# EAGLE design VCNL4040_IR_Finger_Sensor (EAGLE 7.7.0)
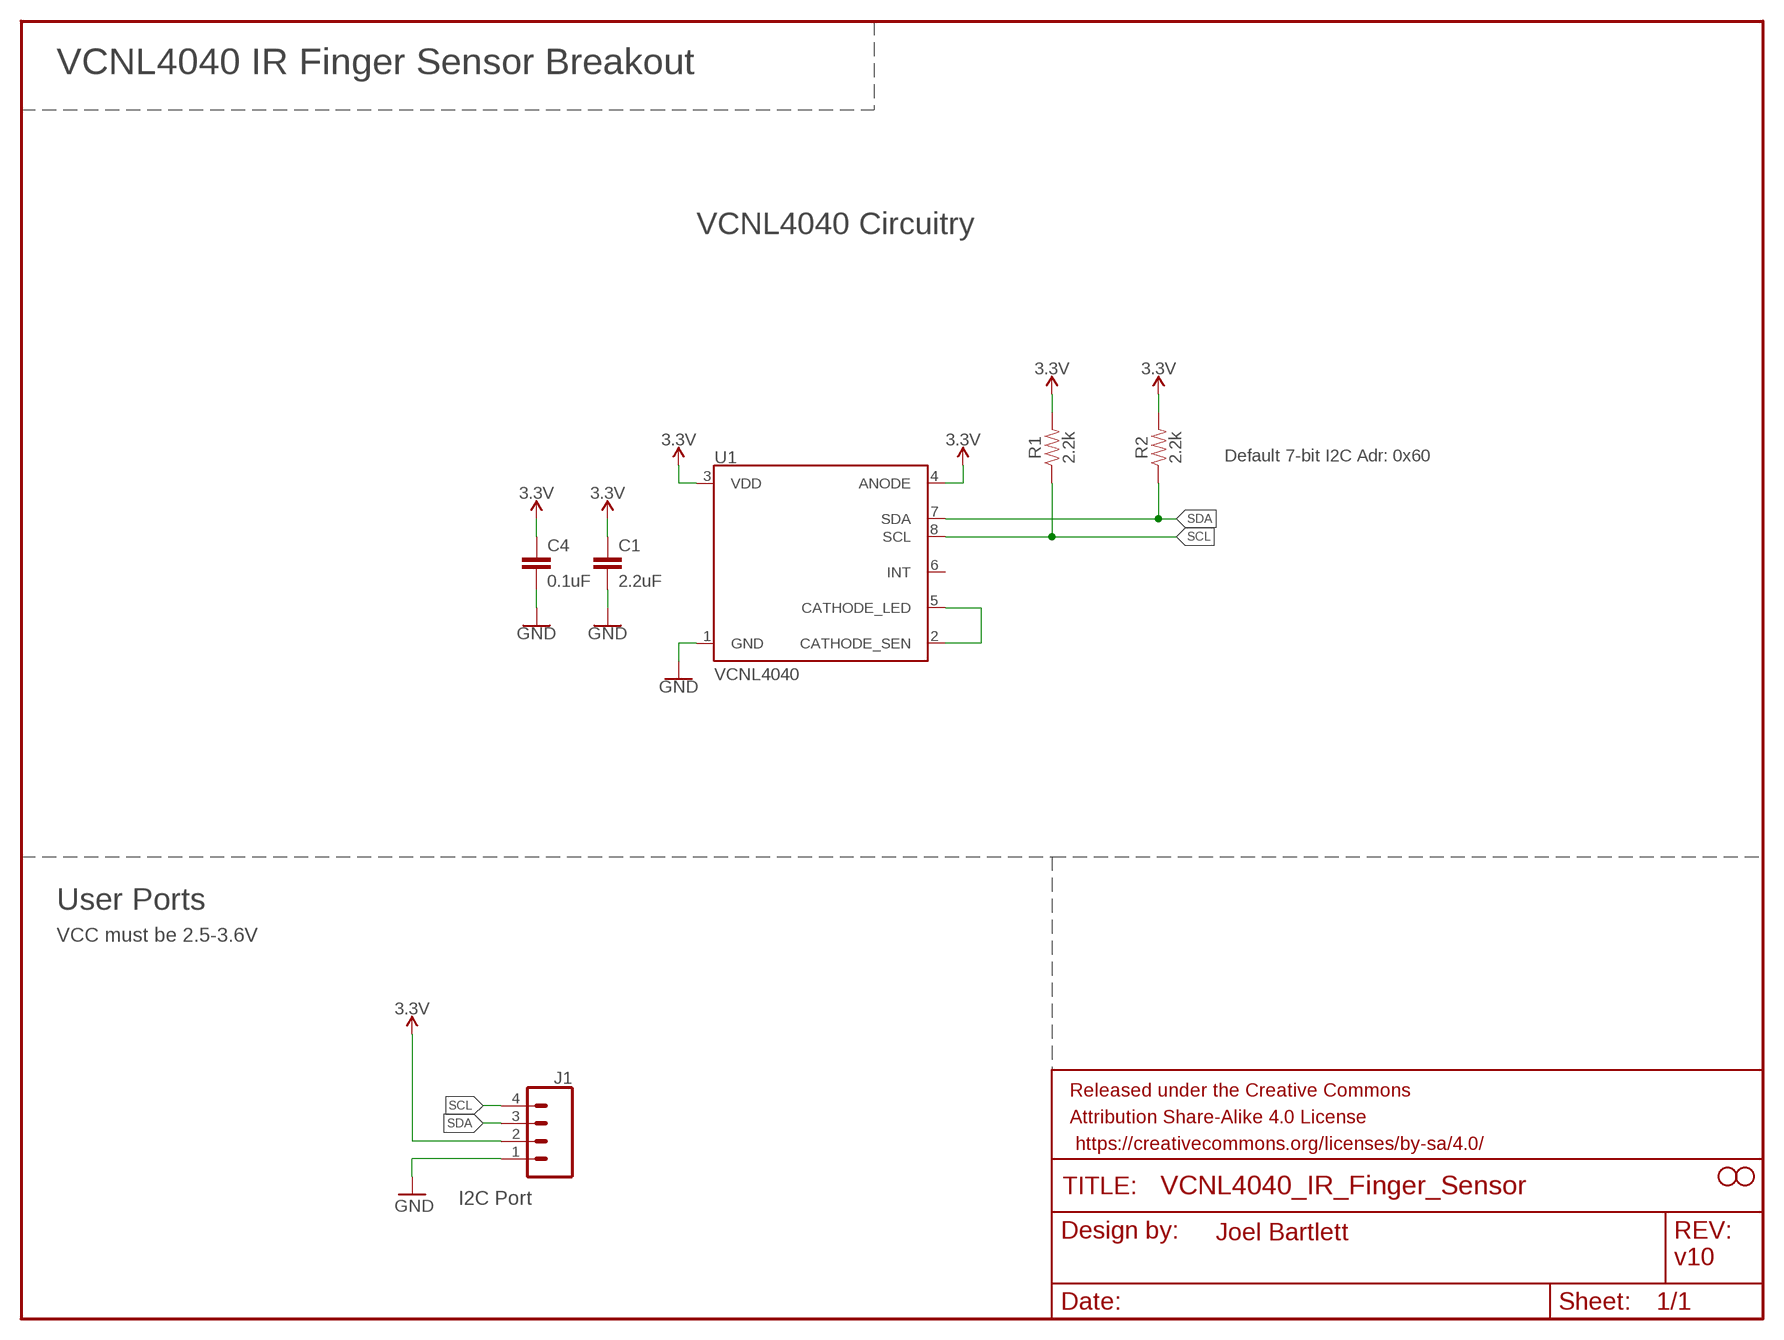
[diagram p0: schematic, sheet 1]

## Parts
C1  2.2uF  2.2UF-0603-10V-20%  [0603]
C4  0.1uF  0.1UF-0603-25V-(+80/-20%)  [0603]
FRAME2  FRAME-LETTER  [CREATIVE_COMMONS]
J1  CONN_04SMD2  [1X04_1MM_RA]
R1  2.2k  2.2KOHM-0603-1/10W-1%  [0603]
R2  2.2k  2.2KOHM-0603-1/10W-1%  [0603]
U1  VCNL4040  [VCNL4040]
U$1  STAND-OFF  [STAND-OFF-#2]
U$2  STAND-OFF  [STAND-OFF-#2]

## Nets
3.3V: C1.1 C4.1 J1.2 R1.2 R2.2 U1.3(VDD) U1.4(ANODE)
GND: C1.2 C4.2 J1.1 U1.1(GND)
N$1: U1.2(CATHODE_SEN) U1.5(CATHODE_LED)
SCL: J1.4 R1.1 U1.8(SCL)
SDA: J1.3 R2.1 U1.7(SDA)
Unconnected: U1.6(INT)

## Notes on the sheet
- VCNL4040 IR Finger Sensor Breakout
- VCNL4040 Circuitry
- Default 7-bit I2C Adr: 0x60
- User Ports
- VCC must be 2.5-3.6V
- I2C Port
- Joel Bartlett
- v10

## Library data of the parts
C1 = SparkFun-Capacitors:2.2UF: 2.2µF ceramic capacitors A capacitor is a passive two-terminal electrical component used to store electrical energy temporarily in an electric field.; PROD_ID: CAP-07888
C4 = SparkFun-Capacitors:0.1UF: 0.1µF ceramic capacitors A capacitor is a passive two-terminal electrical component used to store electrical energy temporarily in an electric field.; PROD_ID: CAP-00810
FRAME2 = SparkFun-Aesthetics:FRAME-LETTER: Schematic Frame Standard 8.5x11 US Letter frame
J1 = SparkFun-Connectors:CONN_04: Multi connection point. Often used as Generic Header-pin footprint for 0.1 inch spaced/style header connections On any of the 0.1 inch spaced packages, you can populate with these: Break Away Headers - Straight <https://www.sparkfun.com/products/116> (PRT-00116) Break Away Male Headers - Right Angle <https://www.sparkfun.com/products/553> (PRT-00553) Female Headers <https://www.sparkfun.com/products/115> (PRT-00115) Break Away Headers - Machine Pin <https://www.sparkfun.com/products/117> (PRT-00117) Break Away Female Headers - Swiss Machine Pin <https://www.sparkfun.com/products/743> (PRT-00743) For SCREWTERMINALS and SPRING TERMINALS visit here: Screw Terimnals on SparkFun.com <https://www.sparkfun.com/search/results?term=Screw+Terminals> (5mm/3.5mm/2.54mm spacing) This device is also useful as a general connection point to wire up your design to another part of your project. Our various solder wires solder well into these plated through hole pads. Hook-Up Wire - Assortment (Stranded, 22 AWG) <https://www.sparkfun.com/products/11375> (PRT-11375) Hook-Up Wire - Assortment (Solid Core, 22 AWG) <https://www.sparkfun.com/products/11367> (PRT-11367) View the entire wire category on our website here <https://www.sparkfun.com/categories/141> Special notes: Molex polarized connector foot print use with SKU : PRT-08231 with associated crimp pins and housings. 1MM SMD Version SKU: PRT-10208; PROD_ID: CONN-10310; SF_ID: PRT-10208
R1 R2 = SparkFun-Resistors:2.2KOHM: 2.2kΩ resistor A resistor is a passive two-terminal electrical component that implements electrical resistance as a circuit element. Resistors act to reduce current flow, and, at the same time, act to lower voltage levels within circuits. - Wikipedia; PROD_ID: RES-08272
U1 = SparkX:VCNL4040
U$1 U$2 = SparkX:STAND-OFF

## Board
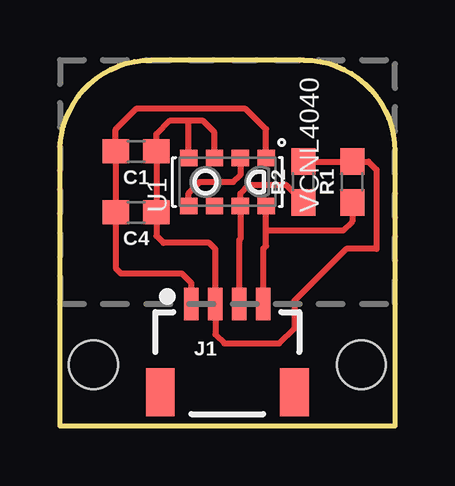
[diagram p1: board, top side]

Size 13.97 x 15.24 mm. Coordinates in mm from the lower left corner, seen from the top.
Outline: 0,0 13.97,0 13.97,11.43 arc90 10.16,15.24 3.81,15.24 arc90 0,11.43 0,0
Copper layers (1*16): Top 0.035mm / dielectric 1.5mm / Bottom 0.035mm
Design rules "SparkFun-2-layer-TIGHT": minimum track width 7mil, minimum drill 15mil, track to track 7mil, track to pad 7mil, pad to pad 7mil, via to via 7mil, smd to smd 7mil, copper to edge 7mil, drill to drill 7mil, minimum pad ring 7mil, minimum via ring 7mil, stop-mask expansion 4mil, vias tented up to drill 25mil, thermal gap 10mil

### Footprints (pad centres in the part's own frame; a part is rotated, then mirrored left to right if it is on the bottom)
0603 = smd 1.1 x 1: 1 -0.85,0; 2 0.85,0
1X04_1MM_RA = smd 0.6 x 1.35: 1 -1.5,0; 2 -0.5,0; 3 0.5,0; 4 1.5,0 | smd 1.2 x 2: NC1 2.8,-3.675; NC2 -2.8,-3.675
VCNL4040 = smd 0.7 x 0.725: 1 1,-1.613; 2 1,-0.537; 3 1,0.537; 4 1,1.613; 5 -1,1.613; 6 -1,0.537; 7 -1,-0.537; 8 -1,-1.613
STAND-OFF-#2 = hole 2.032: 0,0

### Placement (x,y rotation side)
C1  3.17,11.43 180 top
C4  3.17,8.89 180 top
FRAME2  -13.97,-11.43 0 top  (outside the outline)
J1  6.99,5.08 0 top
R1  12.19,10.16 90 top
R2  10.16,10.16 90 top
U1  6.99,10.16 90 top
U$1  1.4,2.54 0 top
U$2  12.57,2.54 0 top

### Tracks (layer width: path | path; a pad name or v marks a point on that pad's centre or on a via)
3.3V
  Top 0.254: U1.3 6.45,12.22 5.97,12.7 5.33,12.7 | 5.33,12.7 4.57,12.7 4.03,12.15 C1.1 C4.1 4.03,7.91 4.32,7.62 6.22,7.62 6.49,7.36 J1.2 6.49,3.8 6.86,3.43 9.14,3.43 9.78,4.06 9.78,5.21 11.94,7.37 13.21,7.37 13.21,10.67 12.87,11.01 R1.2 R2.2 | U1.4 5.37,12.66 5.33,12.7
GND
  Top 0.254: U1.1 8.6,12.36 7.75,13.21 3.17,13.21 2.33,12.36 C1.2 C4.2 2.33,6.57 2.54,6.35 5.08,6.35 5.49,5.95 J1.1
N$1
  Top 0.254: U1.5 5.37,9.69 5.84,10.16 7.24,10.16 7.52,10.44 U1.2
SCL
  Top 0.254: 8.6,8.13 8.6,7.49 8.48,7.38 J1.4 | 8.6,8.13 U1.8 | R1.1 12.19,8.51 11.81,8.13 8.6,8.13
SDA
  Top 0.254: J1.3 7.49,7.74 7.52,7.78 U1.7 7.52,9.68 7.87,10.03 9.44,10.03 R2.1

### Text on the board
tDocu: GooLine